# EAGLE design KX1_DualDeployAltimeter_v100 (EAGLE 6.5.0)
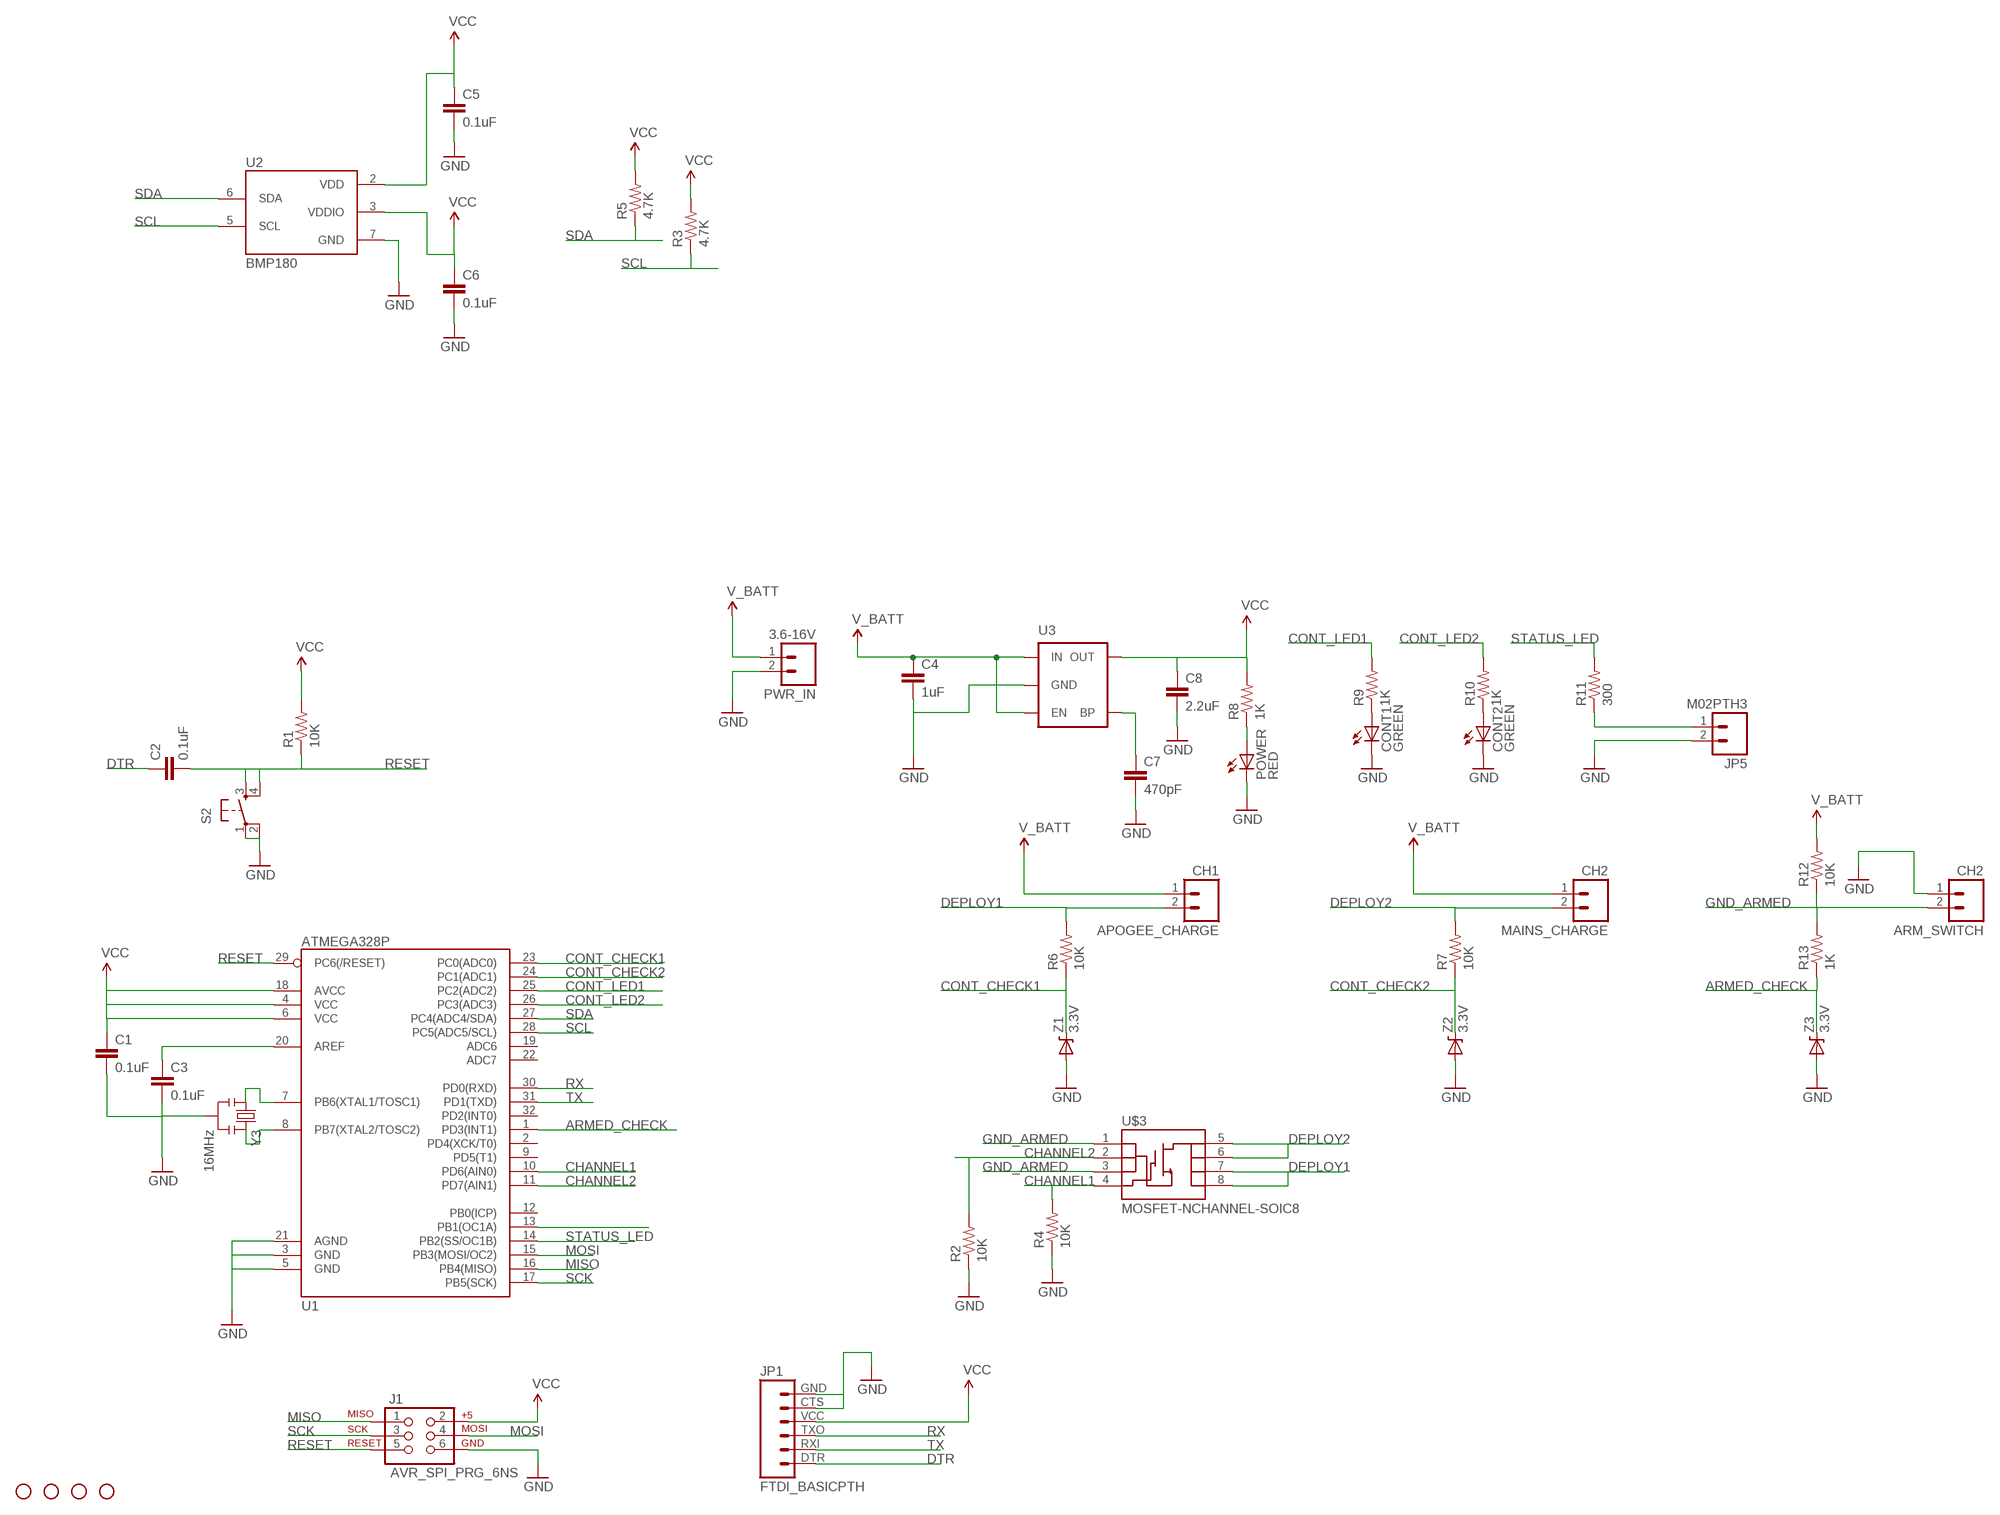
[diagram p0: schematic, sheet 1]

## Parts
APOGEE_CHARGE  CH1  M02PTH3  [1X02_LONGPADS]
ARM_SWITCH  CH2  M02PTH3  [1X02_LONGPADS]
C1  0.1uF  CAP0603-CAP  [0603-CAP]
C2  0.1uF  CAP0603-CAP  [0603-CAP]
C3  0.1uF  0.1UF-25V(+80/-20%)(0603)  [0603-CAP]
C4  1uF  CAP0603-CAP  [0603-CAP]
C5  0.1uF  CAP0603-CAP  [0603-CAP]
C6  0.1uF  CAP0603-CAP  [0603-CAP]
C7  470pF  CAP0603-CAP  [0603-CAP]
C8  2.2uF  CAP0603-CAP  [0603-CAP]
CONT1  GREEN  LED0603  [LED-0603]
CONT2  GREEN  LED0603  [LED-0603]
J1  AVR_SPI_PRG_6NS  [2X3-NS]
JP1  FTDI_BASICPTH  [FTDI_BASIC]
JP5  M02PTH3  [1X02_LONGPADS]
MAINS_CHARGE  CH2  M02PTH3  [1X02_LONGPADS]
POWER  RED  LED0603  [LED-0603]
PWR_IN  3.6-16V  M02PTH3  [1X02_LONGPADS]
R1  10K  RESISTOR0603  [0603-RES]
R2  10K  RESISTOR0603  [0603-RES]
R3  4.7K  RESISTOR0603  [0603-RES]
R4  10K  RESISTOR0603  [0603-RES]
R5  4.7K  RESISTOR0603  [0603-RES]
R6  10K  RESISTOR0603-RES  [0603-RES]
R7  10K  RESISTOR0603-RES  [0603-RES]
R8  1K  RESISTOR0603-RES  [0603-RES]
R9  1K  RESISTOR0603-RES  [0603-RES]
R10  1K  RESISTOR0603-RES  [0603-RES]
R11  300  RESISTOR0603-RES  [0603-RES]
R12  10K  RESISTOR0603  [0603-RES]
R13  1K  RESISTOR0603-RES  [0603-RES]
S2  TAC_SWITCHPTH  [TACTILE-PTH]
STANDOFF1  STAND-OFF  [STAND-OFF]
STANDOFF2  STAND-OFF  [STAND-OFF]
STANDOFF3  STAND-OFF  [STAND-OFF]
STANDOFF4  STAND-OFF  [STAND-OFF]
U1  ATMEGA328P  ATMEGA328_SMT  [TQFP32-08]
U2  BMP180  [BMP180]
U3  MIC52053.3V  [SOT23-5]
U$3  MOSFET-NCHANNEL-SOIC8  [SO08]
Y3  16MHz  RESONATOR16MHZ  [RESONATOR-SMD]
Z1  3.3V  DIODE-ZENER-BZT52  [SOD-323]
Z2  3.3V  DIODE-ZENER-BZT52  [SOD-323]
Z3  3.3V  DIODE-ZENER-BZT52  [SOD-323]

## Nets
ARMED_CHECK: R13.1 U1.1(PD3(INT1)) Z3.1(C)
CHANNEL1: R4.2 U1.10(PD6(AIN0)) U$3.4(G)
CHANNEL2: R2.2 U1.11(PD7(AIN1)) U$3.2(S)
CONT_CHECK1: R6.1 U1.23(PC0(ADC0)) Z1.1(C)
CONT_CHECK2: R7.1 U1.24(PC1(ADC1)) Z2.1(C)
CONT_LED1: R9.2 U1.25(PC2(ADC2))
CONT_LED2: R10.2 U1.26(PC3(ADC3))
DEPLOY1: APOGEE_CHARGE.2 R6.2 U$3.7(D) U$3.8(D)
DEPLOY2: MAINS_CHARGE.2 R7.2 U$3.5(D) U$3.6(D)
DTR: C2.1 JP1.DTR
GND: ARM_SWITCH.1 C1.2 C3.2 C4.2 C5.2 C6.2 C7.2 C8.2 CONT1.C CONT2.C J1.6 JP1.CTS JP1.GND JP5.2 POWER.C PWR_IN.2 R2.1 R4.1 S2.1 S2.2 U1.3(GND) U1.5(GND) U1.21(AGND) U2.7(GND) U3.2(GND) Y3.2 Z1.2(A) Z2.2(A) Z3.2(A)
GND_ARMED: ARM_SWITCH.2 R12.1 R13.2 U$3.1(S) U$3.3(S)
MISO: J1.1 U1.16(PB4(MISO))
MOSI: J1.4 U1.15(PB3(MOSI/OC2))
N$1: POWER.A R8.1
N$2: CONT1.A R9.1
N$3: CONT2.A R10.1
N$4: C3.1 U1.20(AREF)
N$5: U1.7(PB6(XTAL1/TOSC1)) Y3.1
N$6: U1.8(PB7(XTAL2/TOSC2)) Y3.3
N$7: JP5.1 R11.1
N$8: U1.13(PB1(OC1A))
N$9: C7.1 U3.4(BP)
RESET: C2.2 J1.5 R1.1 S2.3 S2.4 U1.29(PC6(/RESET))
RX: JP1.TXO U1.30(PD0(RXD))
SCK: J1.3 U1.17(PB5(SCK))
SCL: R3.1 U1.28(PC5(ADC5/SCL)) U2.5(SCL)
SDA: R5.1 U1.27(PC4(ADC4/SDA)) U2.6(SDA)
STATUS_LED: R11.2 U1.14(PB2(SS/OC1B))
TX: JP1.RXI U1.31(PD1(TXD))
V_BATT: APOGEE_CHARGE.1 C4.1 MAINS_CHARGE.1 PWR_IN.1 R12.2 U3.1(IN) U3.3(EN)
VCC: C1.1 C5.1 C6.1 C8.1 J1.2 JP1.VCC R1.2 R3.2 R5.2 R8.2 U1.4(VCC) U1.6(VCC) U1.18(AVCC) U2.2(VDD) U2.3(VDDIO) U3.5(OUT)
Unconnected: U1.2(PD4(XCK/T0)) U1.9(PD5(T1)) U1.12(PB0(ICP)) U1.19(ADC6) U1.22(ADC7) U1.32(PD2(INT0))

## Library data of the parts
APOGEE_CHARGE ARM_SWITCH JP5 MAINS_CHARGE PWR_IN = SparkFun-Connectors:M02: Standard 2-pin 0.1" header. Use with - straight break away headers ( PRT-00116) - right angle break away headers (PRT-00553) - swiss pins (PRT-00743) - machine pins (PRT-00117) - female headers (PRT-00115) Molex polarized connector foot print use with: PRT-08233 with associated crimp pins and housings. 2.54_SCREWTERM for use with PRT-10571. 3.5mm Screw Terminal footprints for PRT-08084 5mm Screw Terminal footprints for use with PRT-08433
C1 C2 C4-C8 = SparkFun-Capacitors:CAP: Capacitor Standard 0603 ceramic capacitor, and 0.1" leaded capacitor.
C3 = SparkFun-Capacitors:0.1UF-25V(+80/-20%)(0603): Ceramic Standard decoupling cap CAP-00810; PROD_ID: CAP-00810
CONT1 CONT2 POWER = SparkFun-LED:LED: LEDs Standard schematic elements and footprints for 5mm, 3mm, 1206, and 0603 sized LEDs. 5mm - Spark Fun Electronics SKU : COM-00529 (and others)
J1 = SparkFun-Connectors:AVR_SPI_PRG_6: AVR ISP 6 Pin This is the reduced ISP connector for AVR programming. Common on Arduino. This footprint will take up less PCB space and can be used with a 10-pin to 6-pin adapter such as SKU: BOB-08508
JP1 = SparkFun-Connectors:FTDI_BASIC: FTDI Basic header with labels
R1-R5 R12 = SparkFun-Resistors:RESISTOR: Resistor Basic schematic elements and footprints for 0603, 1206, and PTH resistors.
R6-R11 R13 = SparkFun-Passives:RESISTOR: Resistor Basic schematic elements and footprints for 0603, 1206, and PTH resistors.
S2 = SparkFun-Electromechanical:TAC_SWITCH: Momentary Switch Button commonly used for reset or general input. Spark Fun Electronics SKU : COM-00097 SMT- SWCH-08247
STANDOFF1-STANDOFF4 = SparkFun-Electromechanical:STAND-OFF: #4 Stand Off This is the mechanical footprint for a #4 phillips button head screw. Use the keepout ring to avoid running the screw head into surrounding components. SKU : PRT-00447
U1 = SparkFun-DigitalIC:ATMEGA328_SMT: 32-Pin Atmega328 part Commonly used on Arduino compatible boards Available in QFP and QFN packages TQFP is IC-09069 QFN is non-stock; PROD_ID: IC-09069
U2 = SparkFun-Sensors:BMP180: BOSCH BMP180 DIGITAL BAROMETRIC PRESSURE SENSOR Web page: http://www.bosch-sensortec.com/en/homepage/products_3/environmental_sensors_1/bmp180_1/bmp180 Datasheet: http://ae-bst.resource.bosch.com/media/products/dokumente/bmp180/BST-BMP180-DS000-09.pdf The BMP180 is the function compatible successor of the BMP085, a new generation of high precision digital pressure sensors for consumer applications. The ultra-low power, low voltage electronics of the BMP180 is optimized for use in mobile phones, PDAs, GPS navigation devices and outdoor equipment. With a low altitude noise of merely 0.25m at fast conversion time, the BMP180 offers superior performance. The I2C interface allows for easy system integration with a microcontroller. The BMP180 is based on piezo-resistive technology for EMC robustness, high accuracy and linearity as well as long term stability. Key features: - Temperature measurement included - I2C interface - Fully calibrated - Pb-free, halogen-free and RoHS compliant, - MSL 1 Basic specs: Pressure range: 300 to 1100hPa (+9000m to -500m relating to sea level) Supply voltage: 1.8 to 3.6V (VDD), 1.62V to 3.6V (VDDIO) Package: LGA package with metal lid Small footprint: 3.6mm x 3.8mm Super-flat: 0.93mm height Low power: 5μA at 1 sample / sec. in standard mode Low noise: 0.06hPa (0.5m) in ultra low power mode, 0.02hPa (0.17m) advanced resolution mode Typical applications: - Enhancement of GPS navigation (dead-reckoning, slope detection, etc.) - In- and out-door navigation - Leisure and sports - Weather forecast - Vertical velocity indication (rise/sink speed)
U3 = SparkFun-PowerIC:MIC5205: MIC5205 150mA vreg 3.3V - VREG-00822 5V - VREG-00823; PROD_ID: VREG-00822
U$3 = SparkFun:MOSFET-NCHANNEL-SOIC8: N-Channel MOSFET IRF9410 and NDS8434 are common, SOIC-8 parts.
Y3 = SparkFun-FreqCtrl:RESONATOR: Resonator Small SMD resonator. Used, eg, on the Arduino Pro/ Pro Mini boards. 8MHz- XTAL-08895 16MHz- XTAL-08900; PROD_ID: XTAL-08900
Z1-Z3 = SparkFun-DiscreteSemi:DIODE-ZENER: Zener Diode Production Part - 8199 3.4V Zener Voltage

## Board
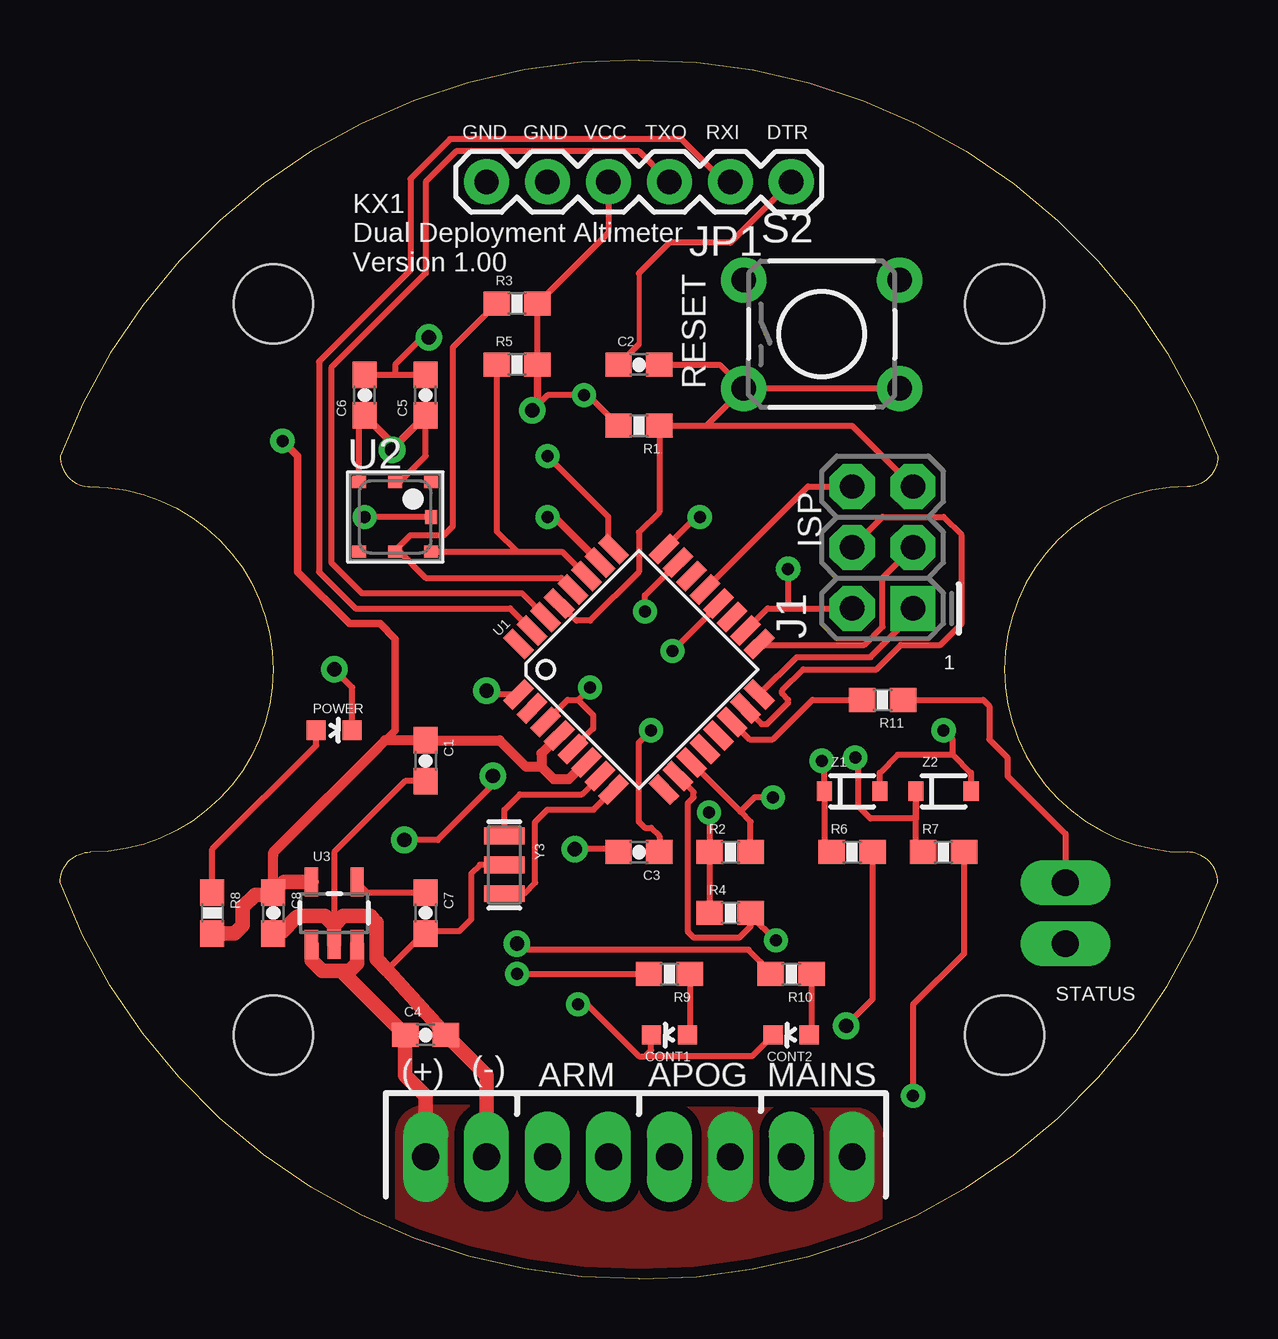
[diagram p1: board, top side]
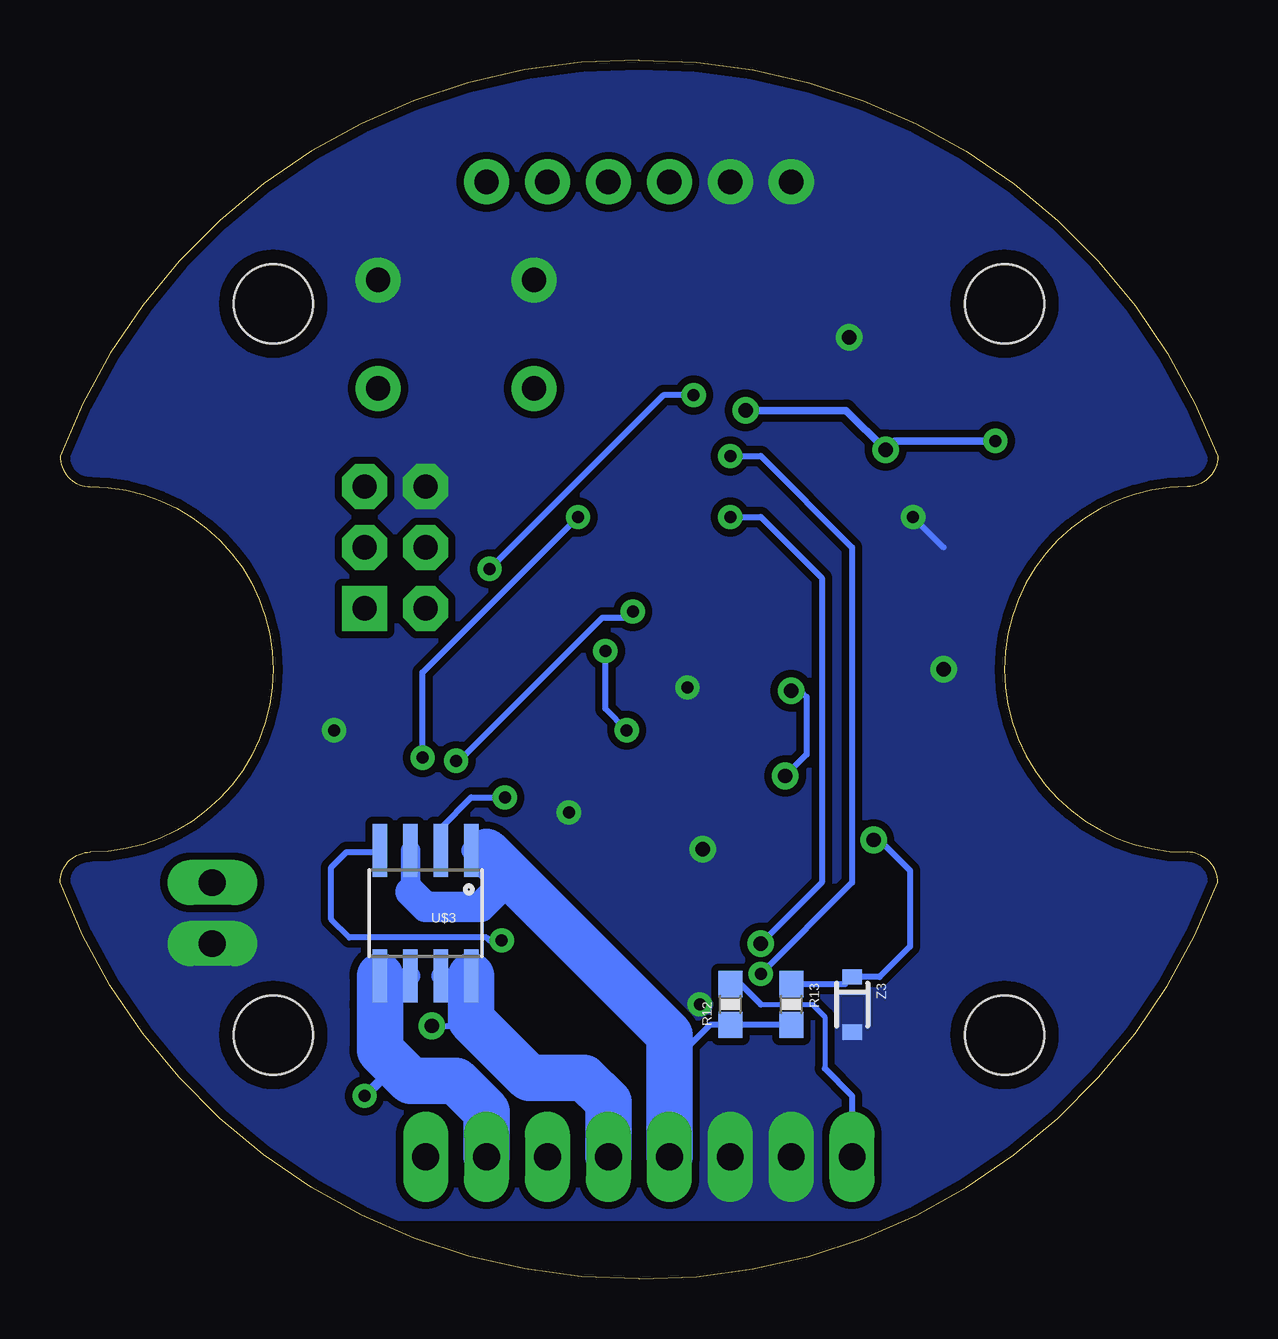
[diagram p2: board, bottom side, seen from below]

Size 48.26 x 50.8 mm. Coordinates in mm from the lower left corner, seen from the top.
Outline: 24.13,50.8 arc-70 48.26,34.29 arc-90 46.99,33.02 arc180 46.99,17.78 arc-90 48.26,16.51 arc-70 24.13,0 arc-70 0,16.51 arc-90 1.27,17.78 arc180 1.27,33.02 arc-90 0,34.29 arc-70 24.13,50.8
Copper layers (1*16): Top 0.0356mm / dielectric 1.5011mm / Bottom 0.0356mm
Design rules "OshPark_Modified": minimum track width 6mil, minimum drill 13mil, track to track 6mil, track to pad 6mil, pad to pad 6mil, via to via 6mil, smd to smd 6mil, copper to edge 15mil, drill to drill 6mil, minimum pad ring 12mil, minimum via ring 10mil, stop-mask expansion 3mil, vias tented up to drill 25mil, thermal gap 10mil

### Footprints (pad centres in the part's own frame; a part is rotated, then mirrored left to right if it is on the bottom)
1X02_LONGPADS = drill 1.118 pad 1.88 long: 1 0,0; 2 2.54,0
0603-CAP = smd 1.1 x 1: 1 -0.85,0; 2 0.85,0
LED-0603 = smd 0.8 x 0.8: A 0,-0.75; C 0,0.75
2X3-NS = drill 1.016 pad 1.88 square: 1 -2.54,-1.27 | drill 1.016 pad 1.88 octagon: 2 -2.54,1.27; 3 0,-1.27; 4 0,1.27; 5 2.54,-1.27; 6 2.54,1.27
FTDI_BASIC = drill 1.016 pad 1.88: CTS 10.16,0; DTR 0,0; GND 12.7,0; RXI 2.54,0; TXO 5.08,0; VCC 7.62,0
0603-RES = smd 1.1 x 1: 1 -0.85,0; 2 0.85,0
TACTILE-PTH = drill 1.016 pad 1.88: 1 -3.251,2.261; 2 3.251,2.261; 3 -3.251,-2.261; 4 3.251,-2.261
STAND-OFF = hole 3.302: 0,0
TQFP32-08 = smd 1.27 x 0.559: 1 -4.293,2.8; 2 -4.293,2; 3 -4.293,1.2; 4 -4.293,0.4; 5 -4.293,-0.4; 6 -4.293,-1.2; 7 -4.293,-2; 8 -4.293,-2.8; 17 4.293,-2.8; 18 4.293,-2; 19 4.293,-1.2; 20 4.293,-0.4; 21 4.293,0.4; 22 4.293,1.2; 23 4.293,2; 24 4.293,2.8 | smd 0.559 x 1.27: 9 -2.8,-4.293; 10 -2,-4.293; 11 -1.2,-4.293; 12 -0.4,-4.293; 13 0.4,-4.293; 14 1.2,-4.293; 15 2,-4.293; 16 2.8,-4.293; 25 2.8,4.293; 26 2,4.293; 27 1.2,4.293; 28 0.4,4.293; 29 -0.4,4.293; 30 -1.2,4.293; 31 -2,4.293; 32 -2.8,4.293
BMP180 = smd 0.6 x 0.5: 1 1.5,1.45; 2 0,1.45; 3 -1.5,1.45; 4 -1.5,-1.45; 5 0,-1.45; 6 1.5,-1.45 | smd 0.5 x 0.6: 7 1.5,0
SOT23-5 = smd 0.55 x 1.2: 1 -0.95,-1.3; 2 0,-1.3; 3 0.95,-1.3; 4 0.95,1.3; 5 -0.95,1.3
SO08 = smd 0.61 x 2.21: 1 -1.905,-2.616; 2 -0.635,-2.616; 3 0.635,-2.616; 4 1.905,-2.616; 5 1.905,2.616; 6 0.635,2.616; 7 -0.635,2.616; 8 -1.905,2.616
RESONATOR-SMD = smd 0.7 x 1.7: 1 -1.2,0; 2 0,0; 3 1.2,0
SOD-323 = smd 0.63 x 0.83: 1 -1.15,0; 2 1.15,0

### Placement (x,y rotation side)
APOGEE_CHARGE  27.94,5.08 180 top
ARM_SWITCH  20.32,5.08 0 top
C1  15.24,21.59 270 top
C2  24.13,38.1 0 top
C3  24.13,17.78 180 top
C4  15.24,10.16 0 top
C5  15.24,36.83 90 top
C6  12.7,36.83 90 top
C7  15.24,15.24 270 top
C8  8.89,15.24 270 top
CONT1  25.4,10.16 90 top
CONT2  30.48,10.16 90 top
J1  34.29,30.48 90 top
JP1  30.48,45.72 180 top
JP5  41.91,16.51 270 top
MAINS_CHARGE  33.02,5.08 180 top
POWER  11.43,22.86 270 top
PWR_IN  15.24,5.08 0 top
R1  24.13,35.56 180 top
R2  27.94,17.78 0 top
R3  19.05,40.64 0 top
R4  27.94,15.24 0 top
R5  19.05,38.1 0 top
R6  33.02,17.78 0 top
R7  36.83,17.78 0 top
R8  6.35,15.24 270 top
R9  25.4,12.7 180 top
R10  30.48,12.7 180 top
R11  34.29,24.13 180 top
R12  20.32,11.43 90 bottom
R13  17.78,11.43 270 bottom
S2  31.75,39.37 0 top
STANDOFF1  8.89,10.16 0 top
STANDOFF2  8.89,40.64 0 top
STANDOFF3  39.37,40.64 0 top
STANDOFF4  39.37,10.16 0 top
U1  24.13,25.4 45 top
U2  13.97,31.75 0 top
U3  11.43,15.24 0 top
U$3  33.02,15.24 180 bottom
Y3  18.52,17.25 270 top
Z1  33.02,20.32 0 top
Z2  36.83,20.32 0 top
Z3  15.24,11.43 270 bottom

### Tracks (layer width: path | path; a pad name or v marks a point on that pad's centre or on a via)
ARMED_CHECK  (via drill 0.6)
  Top 0.254: U1.1 17.95,24.34 v17.78,24.51 | v18.03,20.95 18.03,20.57 15.75,18.29 v14.35,18.29
  Bottom 0.254: v17.78,24.51 17.4,24.51 17.14,24.26 17.14,21.84 v18.03,20.95 | v14.35,18.29 14.1,18.29 12.83,17.02 12.83,13.84 14.1,12.57 Z3.1 15.54,12.28 R13.1
CHANNEL1  (via drill 0.5 pad 0.3)
  Top 0.254: U1.10 26.42,20.29 26.42,20.07 26.16,19.81 26.16,14.48 26.42,14.22 28.32,14.22 28.79,14.69 R4.2 28.79,15.15 v29.84,14.1
  Bottom 0.254: v29.84,14.1 30.35,14.1 30.48,14.22 36.2,14.22 36.96,14.99 36.96,17.14 36.32,17.78 35,17.78 U$3.4
CHANNEL2  (via drill 0.5 pad 0.3)
  Top 0.254: R2.2 28.79,19.04 28.36,19.47 | 28.36,19.47 U1.11 | v29.72,20.07 28.96,20.07 28.36,19.47
  Bottom 0.254: U$3.2 32.38,18.8 31.11,20.07 v29.72,20.07
CONT_CHECK1  (via drill 0.5 pad 0.3)
  Top 0.254: R6.1 31.87,18.08 Z1.1 31.87,21.47 v31.75,21.59 | v24.38,27.81 24.38,28.48 U1.23
  Bottom 0.254: v31.75,21.59 31.62,21.59 25.65,27.56 24.64,27.56 v24.38,27.81
CONT_CHECK2  (via drill 0.5 pad 0.3)
  Top 0.254: R7.1 35.68,18.08 Z2.1 35.68,19.18 33.78,19.18 33.27,19.68 33.27,21.59 v33.15,21.72 | v26.67,31.75 26.52,31.75 U1.24
  Bottom 0.254: v33.15,21.72 33.15,25.27 v26.67,31.75
CONT_LED1  (via drill 0.5 pad 0.3)
  Top 0.254: U1.25 22.86,30.63 22.86,31.75 v20.32,34.29 | v19.05,12.7 R9.2
  Bottom 0.254: v20.32,34.29 19.05,34.29 15.24,30.48 15.24,16.51 v19.05,12.7
CONT_LED2  (via drill 0.5 pad 0.3, 0.6)
  Top 0.254: R10.2 29.63,12.79 28.7,13.72 19.3,13.72 v19.05,13.97
  Top 0.305: v20.32,31.75 20.61,31.75 U1.26
  Bottom 0.254: v20.32,31.75 19.05,31.75 16.51,29.21 16.51,16.51 v19.05,13.97
DEPLOY1  (via drill 0.6)
  Top 0.254: R6.2 33.87,11.64 v32.77,10.54
  Bottom 0.254: v32.77,10.54 31.37,10.54 31.11,10.79
  Bottom 0.813: U$3.7 32.31,12.62 31.11,11.43
  Bottom 1.93: U$3.8 31.11,11.43 31.11,10.79 28.7,8.38 26.42,8.38 25.4,7.37 APOGEE_CHARGE.2
DEPLOY2  (via drill 0.5 pad 0.3)
  Top 0.254: R7.2 37.68,13.55 35.56,11.43 v35.56,7.62
  Bottom 0.406: 34.92,11.43 34.92,8.26 v35.56,7.62
  Bottom 0.813: U$3.6 33.73,12.62 34.92,11.43
  Bottom 1.93: U$3.5 34.92,11.43 34.92,9.53 33.66,8.26 31.75,8.26 30.48,6.99 MAINS_CHARGE.2
DTR
  Top 0.203: 24.13,41.91 24.13,38.95
  Top 0.254: JP1.DTR 27.94,43.18 25.4,43.18 24.13,41.91 | 24.13,38.95 C2.1
GND  (via drill 0.5 pad 0.3, 0.6)
  Top 0.254: U1.21 31.18,33.02 J1.6 | U1.3 21.16,24.13 21.59,24.13 | 21.59,24.13 22.23,23.5 22.23,22.93 U1.5 | 21.59,24.13 v22.1,24.64 | R4.1 R2.1 27.09,19.39 v27.05,19.43 | U2.7 v12.7,31.75 | Z1.2 34.17,21.09 34.92,21.84 37.21,21.84 | 37.21,21.84 37.97,21.08 Z2.2 | 37.21,21.84 37.21,22.48 v36.83,22.86 | C6.2 13.97,37.68 | 13.97,37.68 C5.2 | v15.37,39.24 15.11,39.24 13.97,38.1 13.97,37.68 | v21.59,11.43 21.97,11.43 24.13,9.27 24.38,9.27 | 24.38,9.27 24.64,9.53 24.64,10.15 CONT1.C | CONT2.C 28.84,9.27 24.38,9.27 | POWER.C 12.18,24.65 v11.43,25.4 | Y3.2 17.51,17.25 17.14,16.89 17.14,14.99 16.64,14.48 15.33,14.48 C7.2 15.16,14.39 13.63,12.87 | C3.2 23.15,17.91 v21.46,17.91 | C1.2 14.39,20.74 11.43,17.78 11.43,15.24 11.18,14.99
  Top 0.61: PWR_IN.2 17.78,8.47 C4.2 13.63,12.87 13.21,13.34 13.21,14.86 12.95,15.11 11.81,15.11 11.43,14.73 | 11.43,14.73 11.18,14.99 11.05,15.11 10.01,15.11 arc45 9.83,15.04 9.26,14.46 arc-45 9.08,14.39 C8.2 8.98,14.48 9.27,14.48 | 11.43,14.73 U3.2
  Bottom 0.254: v12.7,31.75 11.43,30.48
  pour Bottom (isolate 0.305, no thermals): 0,2.54 0,50.8 48.26,50.8 48.26,2.54
GND_ARMED
  Bottom 0.254: 22.86,8.89 21.17,10.58 R12.1 R13.2
  Bottom 0.813: 30.48,17.78 31.04,17.78 U$3.1 | U$3.3 33.66,16.13
  Bottom 1.27: 33.66,16.13 33.02,15.49 30.73,15.49 29.46,16.76
  Bottom 1.93: ARM_SWITCH.2 22.86,8.89 22.86,10.16 29.46,16.76 30.48,17.78
MISO
  Top 0.254: U1.16 30.71,25.91 33.78,25.91 35.56,27.69 J1.1
MOSI
  Top 0.254: J1.4 34.29,31.75 36.83,31.75 37.59,30.99 37.59,27.3 36.7,26.42 35.05,26.42 34.04,25.4 30.99,25.4 30.1,24.51 30.1,24.38 30.35,24.13 30.35,24 29.46,23.11 29.24,23.11 U1.15
N$1
  Top 0.254: R8.1 6.35,17.91 10.68,22.24 POWER.A
N$2
  Top 0.254: R9.1 26.25,10.26 CONT1.A
N$3
  Top 0.254: R10.1 31.33,10.26 CONT2.A
N$4  (via drill 0.5 pad 0.3)
  Top 0.254: 27.39,28.15 U1.20 27.45,28.08 v25.53,26.16 | v24.64,22.86 24.13,22.35 24.13,19.05 24.38,18.8 24.64,18.8 24.98,18.45 C3.1
  Bottom 0.254: v24.64,22.86 25.53,23.75 v25.53,26.16
N$5
  Top 0.254: Y3.1 18.52,19.54 19.18,20.19 21.75,20.19 U1.7
N$6
  Top 0.254: Y3.3 19.36,16.05 19.81,16.51 19.81,19.05 20.32,19.56 22.25,19.56 U1.8
N$7
  Top 0.254: R11.1 38.48,24.13 38.73,23.88 38.73,22.48 39.5,21.72 39.5,20.95 41.91,18.54 JP5.1
N$9
  Top 0.254: C7.1 12.83,16.09 U3.4
RESET
  Top 0.254: C2.2 27.51,38.1 S2.3 | R1.1 26.95,35.56 S2.3 | R1.1 33.02,35.56 J1.5 | S2.4 S2.3 | R1.1 24.98,31.96 24.13,31.11 24.13,29.46 22.1,27.43 21.53,27.43 U1.29
RX
  Top 0.254: JP1.TXO 24.13,46.99 16.51,46.99 15.24,45.72 15.24,41.91 11.3,37.97 11.3,29.84 12.57,28.57 19.26,28.57 U1.30
SCK
  Top 0.203: U1.17 29.23,26.54
  Top 0.254: 29.23,26.54 29.36,26.42 33.53,26.42 34.29,27.18 34.29,29.21 J1.3
SCL
  Top 0.254: U2.5 14.15,30.3 | 14.15,30.3 15.24,29.21 20.89,29.21 U1.28 | 14.15,30.3 14.15,30.53 14.61,30.99 16,30.99 16.38,31.37 16.38,38.82 R3.1
SDA
  Top 0.254: U2.6 19.05,30.3 | 19.05,30.3 20.93,30.3 U1.27 | R5.1 18.2,31.15 19.05,30.3
STATUS_LED
  Top 0.254: U1.14 28.75,22.48 29.72,22.48 31.37,24.13 R11.2
TX
  Top 0.254: JP1.RXI 27.69,45.72 25.91,47.5 16.26,47.5 14.61,45.85 14.61,42.04 10.79,38.23 10.79,29.46 12.32,27.94 18.76,27.94 U1.31
V_BATT
  Top 0.61: PWR_IN.1 15.24,7.62 14.39,8.47 C4.1 11.72,12.83 | 11.72,12.83 10.92,12.83 10.48,13.27 U3.1 | 11.72,12.83 12.06,12.83 12.38,13.14 U3.3
  Bottom 0.203: 19.05,11.43 16.89,11.43 16.38,10.92 16.38,8.76
  Bottom 0.254: R12.2 19.9,12.28 19.05,11.43 | 16.38,8.76 15.24,7.62 PWR_IN.1
  pour Top (isolate 0.406, no thermals): 15.24,7.24 arc90 13.97,5.97 13.97,0 34.29,0 34.29,5.84 arc90 33.27,7.11
VCC  (via drill 0.5 pad 0.3, 0.6)
  Top 0.203: 13.97,26.67 13.97,24.51
  Top 0.254: U1.18 29.5,27.94 30.48,27.94 | 30.48,27.94 J1.2 | 21.9,21.52 U1.6 21.94,21.69 | 22.86,35.56 R1.2 22.01,36.83 v21.84,36.83 20.32,36.83 v19.68,36.2 | v30.35,29.59 30.35,28.07 30.48,27.94 | R5.2 R3.2 | 19.94,40.68 R3.2 | U2.3 12.47,35.75 C6.1 | U2.2 14.15,33.2 15.24,34.29 C5.1 | 13.84,34.84 v13.84,34.54 13.84,34.58 | 13.34,22.1 8.89,17.65 8.89,17.4 | JP1.VCC 22.86,43.6 R3.2
  Top 0.305: v9.27,34.92 9.91,34.29 9.91,29.46 12.06,27.3 13.34,27.3 13.97,26.67 13.97,22.86 13.55,22.44 | 13.84,34.84 C6.1 | 13.84,34.58 C5.1 | R5.2 19.9,36.41 v19.68,36.2
  Top 0.406: U1.4 20.07,21.9 20.07,21.34 | 20.07,21.34 20.57,20.83 21.21,20.83 21.9,21.52 | 20.07,21.34 19.43,21.34 18.33,22.44 C1.1 13.55,22.44 8.89,17.78 8.89,17.65 8.89,16.51 | C8.1 8.89,16.51 | 8.89,16.51 9.31,16.51 9.34,16.54
  Top 0.61: 9.34,16.54 U3.5 | R8.2 7.28,14.39 7.62,14.73 7.62,15.49 8.13,16 8.8,16 C8.1
  Bottom 0.254: v21.84,36.83 23.11,36.83 v30.35,29.59
  Bottom 0.305: v9.27,34.92 13.46,34.92 v13.84,34.54 15.49,36.2 v19.68,36.2

### Text on the board
tPlace: GND | GND | VCC | TXO | RXI | DTR | KX1 / Dual Deployment Altimeter / Version 1.00 | RESET | ISP | 1 | STATUS | (+) | (-) | ARM | APOG | MAINS